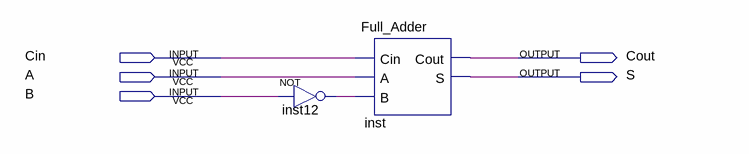
[diagram p0: schematic sheet]
// Quartus schematic ATruB_1Bit.bdf as structural Verilog: 2 symbols, 5 pins
module ATruB_1Bit (
  input  Cin,
  input  A,
  input  B,
  output Cout,
  output S
);

  wire inst12_out;

  not inst12 (inst12_out, B);
  Full_Adder inst (.Cin(Cin), .A(A), .B(inst12_out), .Cout(Cout), .S(S));
endmodule
